# EasyEDA Pro project ProPrj_PRISM101 Scanner Backlight_2026-04-10.epro, board PRISM101 Backlight 4x6 RGBIR 20260324
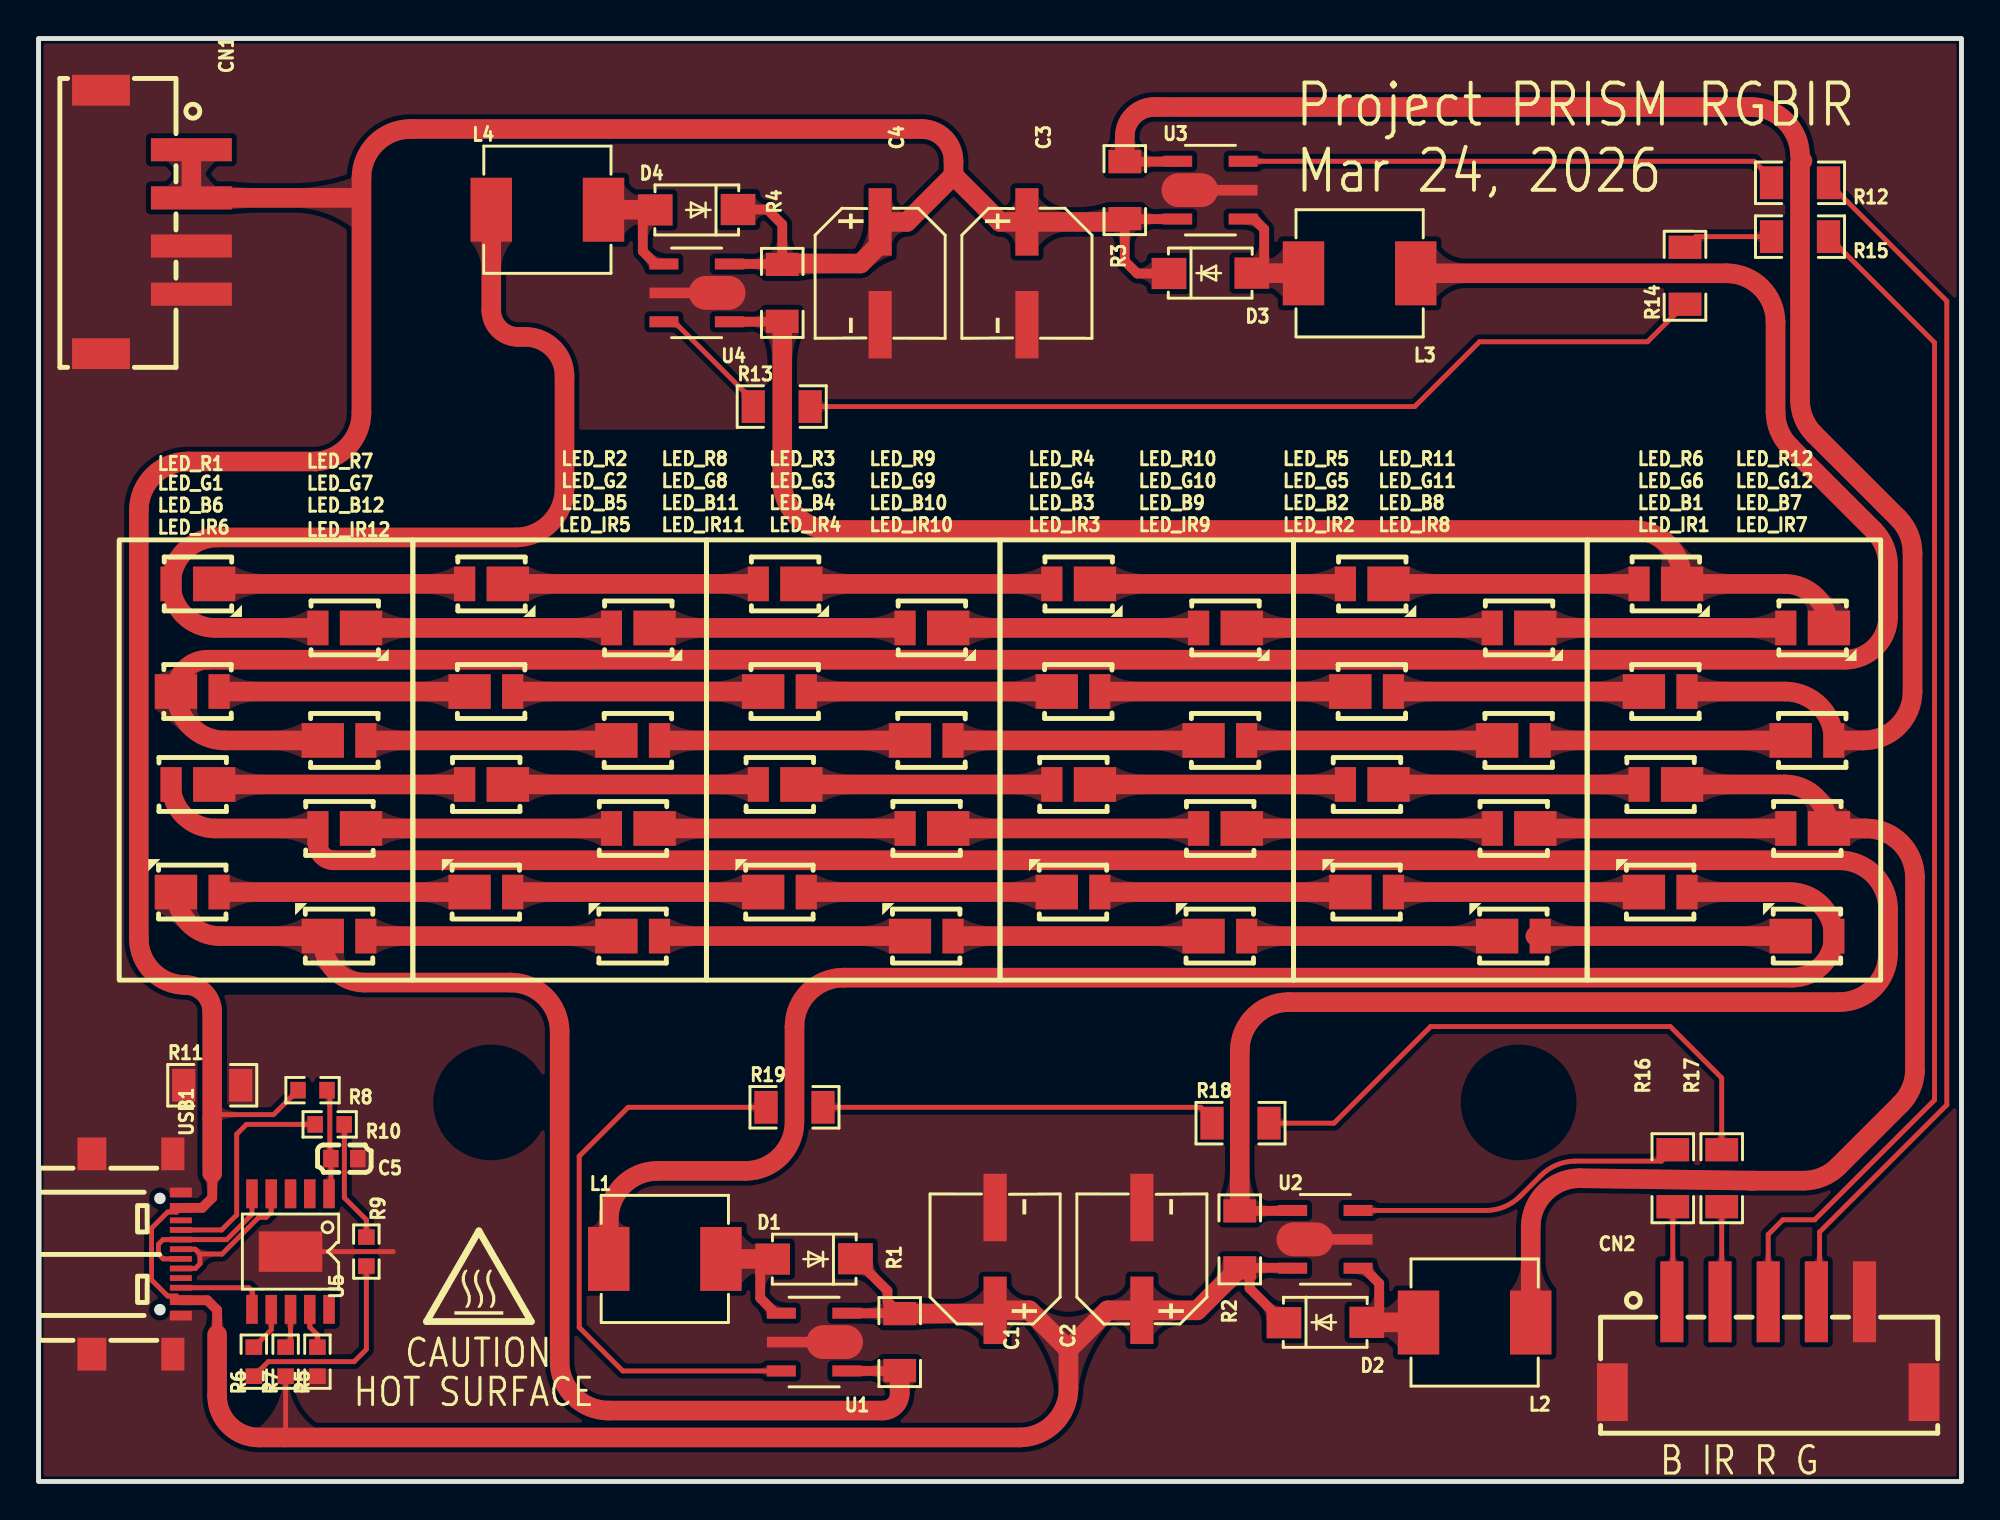
[diagram p7: board, top side]
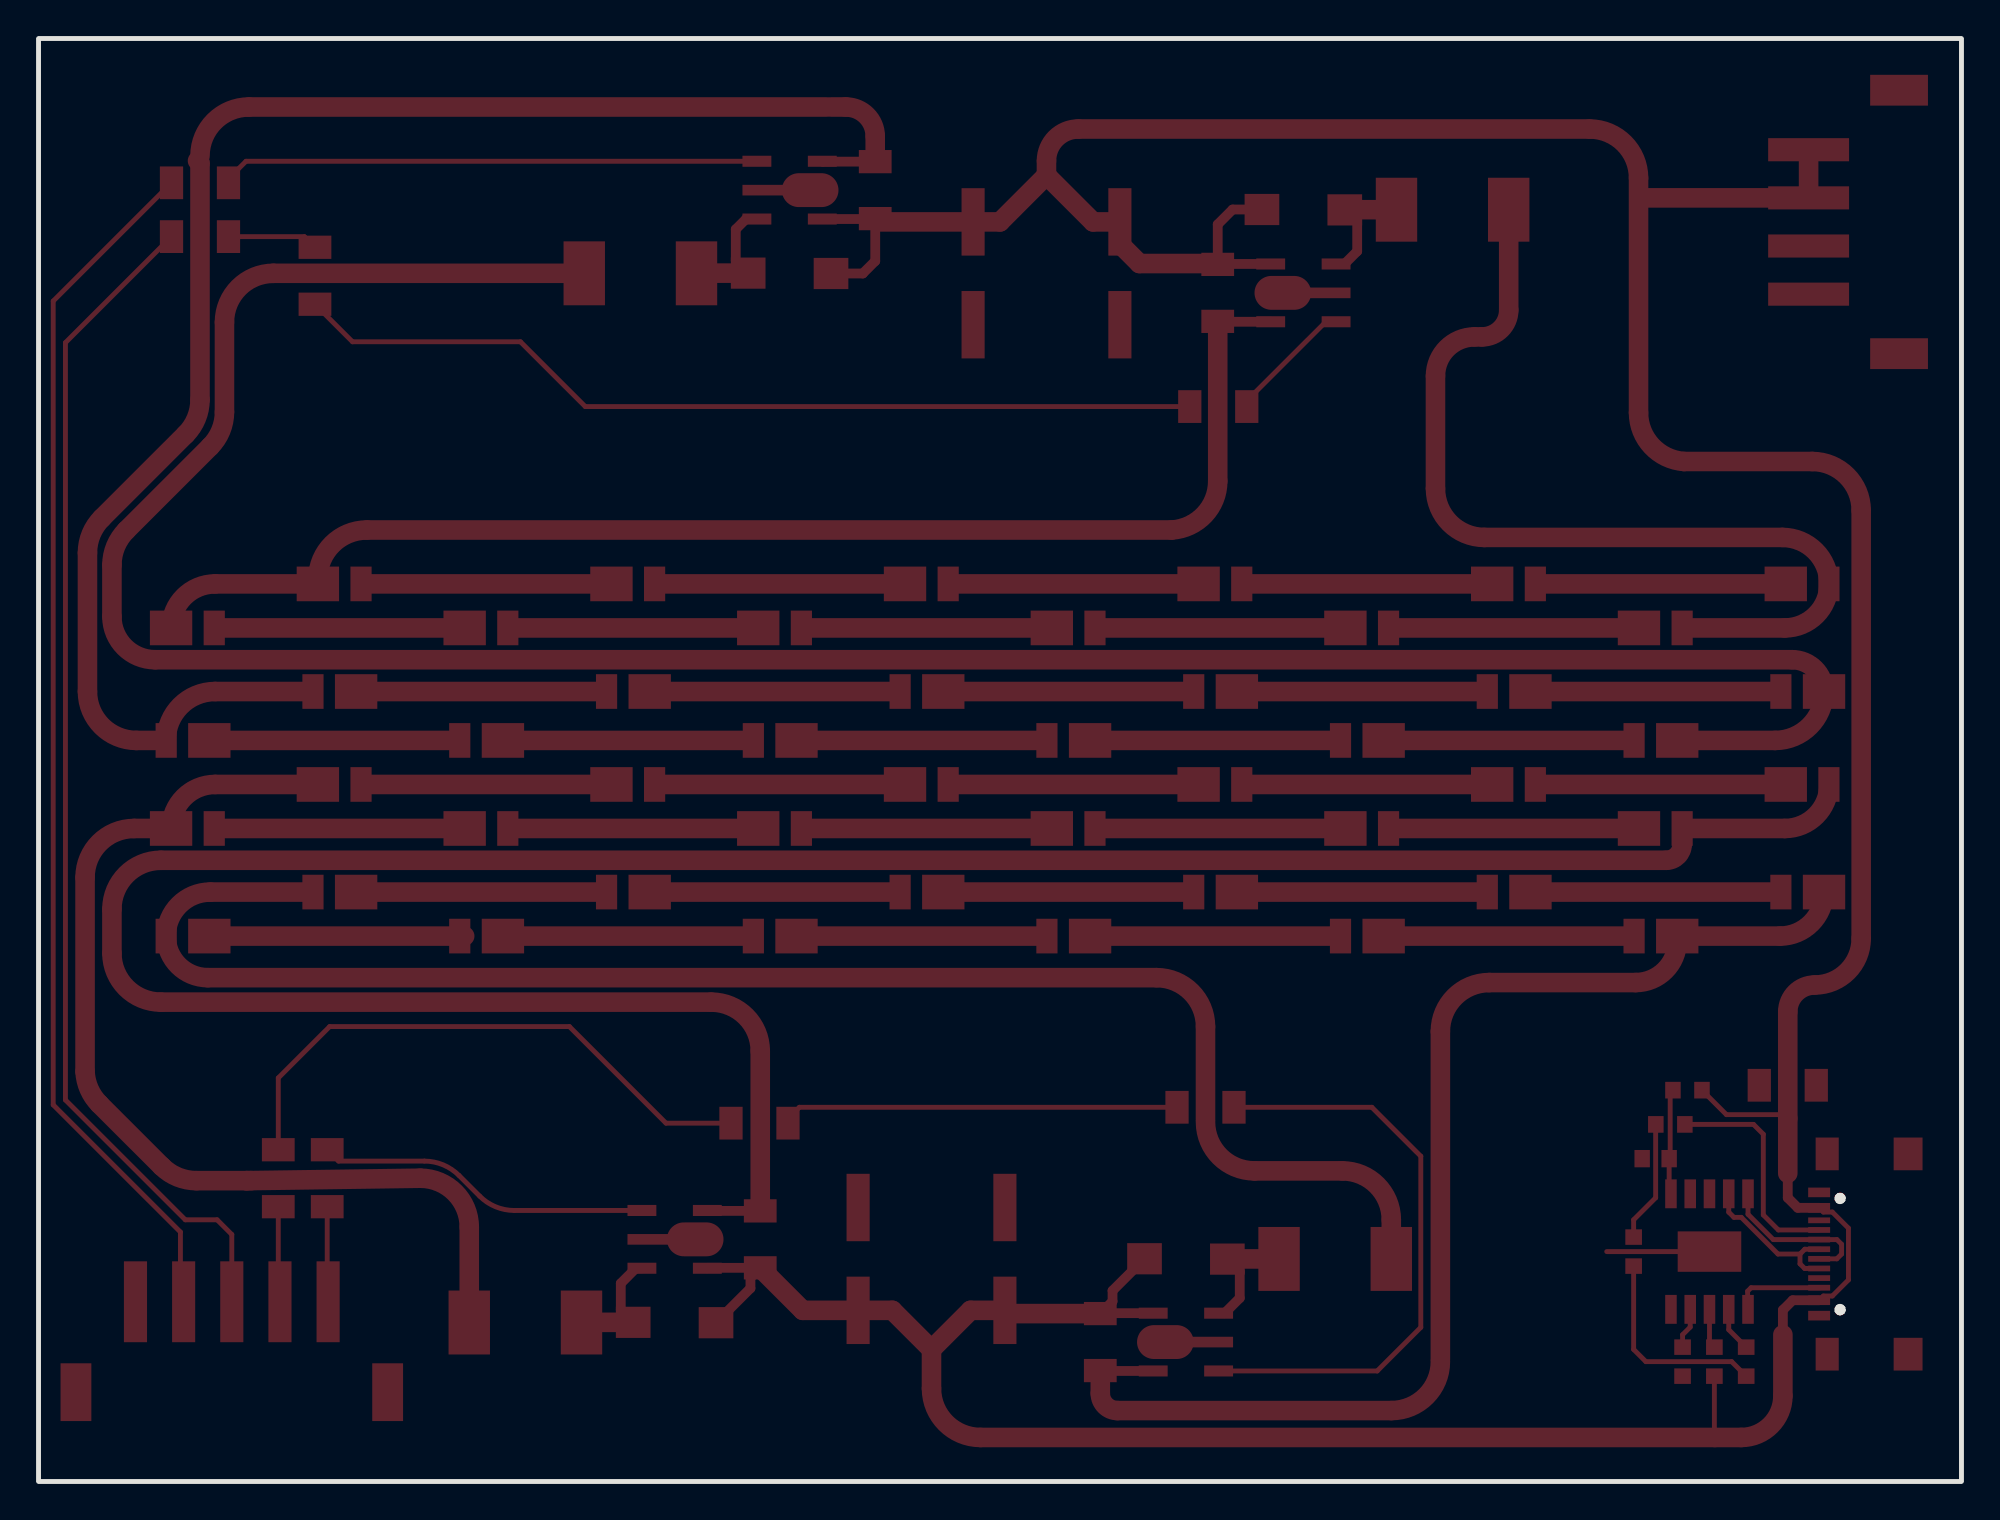
[diagram p8: board, bottom side, seen from below]

Outline 99.82 x 74.93 mm; copper layers: Top Layer, Bottom Layer. Coordinates in mm from the lower left corner of the outline.
Outline path: rectangle 0,74.93 99.82,0
Stack: Top Layer 0.035mm / Dielectric1 1.51mm FR4 er 4.5 / Bottom Layer 0.035mm

## Design rules (mm)
spacing copperThickness1oz (default): track to track 0.102, other pairs 0.152 to 0.3
spacing copperThickness2oz: track to track 0.203, other pairs 0.152 to 0.3
track width copperThickness1oz (default): min 0.127, default 0.254, max 2.54
track width copperThickness2oz: min 0.203, default 0.254, max 2.54
differential pair differentialPair (default): width min 0.127, default 0.254, max 2.54; gap min 0.152, default 0.152

## Placement (name value [footprint] x y rotation side)
C1  100uF  [CAP-SMD_BD6.3-L6.6-W6.6-LS7.3-FD-H7.7]  49.66 11.56 90 top
C2  100uF  [CAP-SMD_BD6.3-L6.6-W6.6-LS7.3-FD-H7.7]  57.28 11.56 90 top
C3  100uF  [CAP-SMD_BD6.3-L6.6-W6.6-LS7.3-FD-H7.7]  51.31 62.74 270 top
C4  100uF  [CAP-SMD_BD6.3-L6.6-W6.6-LS7.3-FD-H7.7]  43.69 62.74 270 top
C5  1uF  [C0603]  15.88 16.76 0 top
CN1  UK-2.54-4ALT  [CONN-SMD_UK-2.54-4ALT]  5.59 65.41 270 top
CN2  UK-2.54-5ALT  [CONN-SMD_5P-P2.50_UK-2.54-5ALT]  89.79 6.99 0 top
D1  SS36  [SMA_L4.3-W2.6-LS5.0-FD]  40.26 11.56 0 top
D2  SS36  [SMA_L4.3-W2.6-LS5.0-FD]  66.8 8.25 180 top
D3  SS36  [SMA_L4.3-W2.6-LS5.0-FD]  60.83 62.74 180 top
D4  SS36  [SMA_L4.3-W2.6-LS5.0-FD]  34.16 66.04 0 top
HOTSURFACE  CAUTION HOT SURFACE  [IEC_HotSurface_Small]  22.86 10.67 0 top
L1  68uH  [IND-SMD_L7.1-W6.6_H5.0]  32.51 11.56 0 top
L2  68uH  [IND-SMD_L7.1-W6.6_H5.0]  74.55 8.25 180 top
L3  68uH  [IND-SMD_L7.1-W6.6_H5.0]  68.58 62.74 180 top
L4  68uH  [IND-SMD_L7.1-W6.6_H5.0]  26.42 66.04 0 top
LED_B1  JE2835ARY-N-0002A0000-N0000001  [LED-SMD_L3.5-W2.8-JE2835BWT-N]  84.2 36.2 180 top
LED_B2  JE2835ARY-N-0002A0000-N0000001  [LED-SMD_L3.5-W2.8-JE2835BWT-N]  68.96 36.2 180 top
LED_B3  JE2835ARY-N-0002A0000-N0000001  [LED-SMD_L3.5-W2.8-JE2835BWT-N]  53.72 36.2 180 top
LED_B4  JE2835ARY-N-0002A0000-N0000001  [LED-SMD_L3.5-W2.8-JE2835BWT-N]  38.48 36.2 180 top
LED_B5  JE2835ARY-N-0002A0000-N0000001  [LED-SMD_L3.5-W2.8-JE2835BWT-N]  23.24 36.2 180 top
LED_B6  JE2835ARY-N-0002A0000-N0000001  [LED-SMD_L3.5-W2.8-JE2835BWT-N]  8 36.2 180 top
LED_B7  JE2835ARY-N-0002A0000-N0000001  [LED-SMD_L3.5-W2.8-JE2835BWT-N]  91.82 33.91 180 top
LED_B8  JE2835ARY-N-0002A0000-N0000001  [LED-SMD_L3.5-W2.8-JE2835BWT-N]  76.58 33.91 180 top
LED_B9  JE2835ARY-N-0002A0000-N0000001  [LED-SMD_L3.5-W2.8-JE2835BWT-N]  61.34 33.91 180 top
LED_B10  JE2835ARY-N-0002A0000-N0000001  [LED-SMD_L3.5-W2.8-JE2835BWT-N]  46.1 33.91 180 top
LED_B11  JE2835ARY-N-0002A0000-N0000001  [LED-SMD_L3.5-W2.8-JE2835BWT-N]  30.86 33.91 180 top
LED_B12  JE2835ARY-N-0002A0000-N0000001  [LED-SMD_L3.5-W2.8-JE2835BWT-N]  15.62 33.91 180 top
LED_G1  JE2835AGR-N-0002A0000-N0000001  [LED-SMD_L3.5-W2.8-JE2835BWT-N]  8.25 41.02 0 top
LED_G2  JE2835AGR-N-0002A0000-N0000001  [LED-SMD_L3.5-W2.8-JE2835BWT-N]  23.5 41.02 0 top
LED_G3  JE2835AGR-N-0002A0000-N0000001  [LED-SMD_L3.5-W2.8-JE2835BWT-N]  38.74 41.02 0 top
LED_G4  JE2835AGR-N-0002A0000-N0000001  [LED-SMD_L3.5-W2.8-JE2835BWT-N]  53.97 41.02 0 top
LED_G5  JE2835AGR-N-0002A0000-N0000001  [LED-SMD_L3.5-W2.8-JE2835BWT-N]  69.22 41.02 0 top
LED_G6  JE2835AGR-N-0002A0000-N0000001  [LED-SMD_L3.5-W2.8-JE2835BWT-N]  84.46 41.02 0 top
LED_G7  JE2835AGR-N-0002A0000-N0000001  [LED-SMD_L3.5-W2.8-JE2835BWT-N]  15.88 38.48 0 top
LED_G8  JE2835AGR-N-0002A0000-N0000001  [LED-SMD_L3.5-W2.8-JE2835BWT-N]  31.12 38.48 0 top
LED_G9  JE2835AGR-N-0002A0000-N0000001  [LED-SMD_L3.5-W2.8-JE2835BWT-N]  46.35 38.48 0 top
LED_G10  JE2835AGR-N-0002A0000-N0000001  [LED-SMD_L3.5-W2.8-JE2835BWT-N]  61.59 38.48 0 top
LED_G11  JE2835AGR-N-0002A0000-N0000001  [LED-SMD_L3.5-W2.8-JE2835BWT-N]  76.84 38.48 0 top
LED_G12  JE2835AGR-N-0002A0000-N0000001  [LED-SMD_L3.5-W2.8-JE2835BWT-N]  92.07 38.48 0 top
LED_IR1  JE2835AFR-N-0001A0000-N0000001  [LED-SMD_L3.5-W2.8_JE2835APO-N-0001A0000-N0000001]  84.46 30.61 180 top
LED_IR2  JE2835AFR-N-0001A0000-N0000001  [LED-SMD_L3.5-W2.8_JE2835APO-N-0001A0000-N0000001]  69.22 30.61 180 top
LED_IR3  JE2835AFR-N-0001A0000-N0000001  [LED-SMD_L3.5-W2.8_JE2835APO-N-0001A0000-N0000001]  53.97 30.61 180 top
LED_IR4  JE2835AFR-N-0001A0000-N0000001  [LED-SMD_L3.5-W2.8_JE2835APO-N-0001A0000-N0000001]  38.74 30.61 180 top
LED_IR5  JE2835AFR-N-0001A0000-N0000001  [LED-SMD_L3.5-W2.8_JE2835APO-N-0001A0000-N0000001]  23.5 30.61 180 top
LED_IR6  JE2835AFR-N-0001A0000-N0000001  [LED-SMD_L3.5-W2.8_JE2835APO-N-0001A0000-N0000001]  8.25 30.61 180 top
LED_IR7  JE2835AFR-N-0001A0000-N0000001  [LED-SMD_L3.5-W2.8_JE2835APO-N-0001A0000-N0000001]  92.07 28.32 180 top
LED_IR8  JE2835AFR-N-0001A0000-N0000001  [LED-SMD_L3.5-W2.8_JE2835APO-N-0001A0000-N0000001]  76.84 28.32 180 top
LED_IR9  JE2835AFR-N-0001A0000-N0000001  [LED-SMD_L3.5-W2.8_JE2835APO-N-0001A0000-N0000001]  61.59 28.32 180 top
LED_IR10  JE2835AFR-N-0001A0000-N0000001  [LED-SMD_L3.5-W2.8_JE2835APO-N-0001A0000-N0000001]  46.35 28.32 180 top
LED_IR11  JE2835AFR-N-0001A0000-N0000001  [LED-SMD_L3.5-W2.8_JE2835APO-N-0001A0000-N0000001]  31.12 28.32 180 top
LED_IR12  JE2835AFR-N-0001A0000-N0000001  [LED-SMD_L3.5-W2.8_JE2835APO-N-0001A0000-N0000001]  15.88 28.32 180 top
LED_R1  JE2835AHR-N-0001A0000-N0000001  [LED-SMD_L3.5-W2.8_JE2835APO-N-0001A0000-N0000001]  8 46.61 0 top
LED_R2  JE2835AHR-N-0001A0000-N0000001  [LED-SMD_L3.5-W2.8_JE2835APO-N-0001A0000-N0000001]  23.24 46.61 0 top
LED_R3  JE2835AHR-N-0001A0000-N0000001  [LED-SMD_L3.5-W2.8_JE2835APO-N-0001A0000-N0000001]  38.48 46.61 0 top
LED_R4  JE2835AHR-N-0001A0000-N0000001  [LED-SMD_L3.5-W2.8_JE2835APO-N-0001A0000-N0000001]  53.72 46.61 0 top
LED_R5  JE2835AHR-N-0001A0000-N0000001  [LED-SMD_L3.5-W2.8_JE2835APO-N-0001A0000-N0000001]  68.96 46.61 0 top
LED_R6  JE2835AHR-N-0001A0000-N0000001  [LED-SMD_L3.5-W2.8_JE2835APO-N-0001A0000-N0000001]  84.2 46.61 0 top
LED_R7  JE2835AHR-N-0001A0000-N0000001  [LED-SMD_L3.5-W2.8_JE2835APO-N-0001A0000-N0000001]  15.62 44.32 0 top
LED_R8  JE2835AHR-N-0001A0000-N0000001  [LED-SMD_L3.5-W2.8_JE2835APO-N-0001A0000-N0000001]  30.86 44.32 0 top
LED_R9  JE2835AHR-N-0001A0000-N0000001  [LED-SMD_L3.5-W2.8_JE2835APO-N-0001A0000-N0000001]  46.1 44.32 0 top
LED_R10  JE2835AHR-N-0001A0000-N0000001  [LED-SMD_L3.5-W2.8_JE2835APO-N-0001A0000-N0000001]  61.34 44.32 0 top
LED_R11  JE2835AHR-N-0001A0000-N0000001  [LED-SMD_L3.5-W2.8_JE2835APO-N-0001A0000-N0000001]  76.58 44.32 0 top
LED_R12  JE2835AHR-N-0001A0000-N0000001  [LED-SMD_L3.5-W2.8_JE2835APO-N-0001A0000-N0000001]  91.82 44.32 0 top
R1  0.3R  [R1206]  44.7 7.24 270 top
R2  0.3R  [R1206]  62.36 12.57 90 top
R3  0.3R  [R1206]  56.39 67.06 90 top
R4  0.3R  [R1206]  38.61 61.72 270 top
R5  NC / 120K  [R0603]  14.48 6.22 270 top
R6  0R  [R0603]  11.18 6.22 90 top
R7  10K / 0R  [R0603]  12.83 6.22 270 top
R8  1K / 0R  [R0603]  14.22 20.32 0 top
R9  0R  [R0603]  17.02 11.94 90 top
R10  0R  [R0603]  15.11 18.54 180 top
R11  0R  [R1206]  9.02 20.57 0 top
R12  0R  [R1206]  91.44 67.44 0 top
R13  0R  [R1206]  38.58 55.82 0 top
R14  0R  [R1206]  85.47 62.61 90 top
R15  0R  [R1206]  91.44 64.64 0 top
R16  0R  [R1206]  84.84 15.75 270 top
R17  0R  [R1206]  87.38 15.75 270 top
R18  0R  [R1206]  62.4 18.61 0 top
R19  0R  [R1206]  39.24 19.43 0 top
U1  PT4115  [SOT-89-5_L4.5-W2.5-P1.50-LS4.5-BR]  40.26 7.24 180 top
U2  PT4115  [SOT-89-5_L4.5-W2.5-P1.50-LS4.5-BR]  66.8 12.57 0 top
U3  PT4115  [SOT-89-5_L4.5-W2.5-P1.50-LS4.5-BR]  60.83 67.06 0 top
U4  PT4115  [SOT-89-5_L4.5-W2.5-P1.50-LS4.5-BR]  34.16 61.72 180 top
U5  CH224K / CH224A  [ESSOP-10_L4.9-W3.9-P1.0-LS6.0-TL-EP]  13.08 11.94 180 top
USB1  TYPE-C 16P QTWT  [USB-TYPE-C-SMD_TYPE-C-16P-QTWT]  5.08 11.81 270 top

## Footprints (pads in the part's own frame, mm; a bottom-side part is the same pattern mirrored in y, then rotated)
C0603
  rect 0.8x0.9 smd: 1(-0.7,0) 2(0.7,0)
CAP-SMD_BD6.3-L6.6-W6.6-LS7.3-FD-H7.7
  rect 3.5x1.2 smd: 1(-2.67,0) 2(2.67,0)
CONN-SMD_5P-P2.50_UK-2.54-5ALT
  rect 1.2x4.2 smd: 1(-5,2.348) 2(-2.5,2.348) 3(0,2.348) 4(2.5,2.348) 5(5,2.348)
  rect 1.6x3 smd: 6(8.09,-2.348) 7(-8.09,-2.348)
CONN-SMD_UK-2.54-4ALT
  rect 1.2x4.2 smd: 1(-3.75,2.348) 2(-1.25,2.348) 3(1.25,2.348) 4(3.75,2.348)
  rect 1.6x3 smd: 5(6.84,-2.348) 6(-6.84,-2.348)
ESSOP-10_L4.9-W3.9-P1.0-LS6.0-TL-EP
  rect 0.6x1.5 smd: 1(-2,-3) 2(-1,-3) 3(0,-3) 4(1,-3) 5(2,-3) 6(2,3) 7(1,3) 8(0,3) 9(-1,3) 10(-2,3)
  rect 3.3x2.1 smd: 11(0,0)
IND-SMD_L7.1-W6.6_H5.0
  rect 2.15x3.32 smd: 1(-2.913,0) 2(2.913,0)
LED-SMD_L3.5-W2.8-JE2835BWT-N
  rect 2.2x1.8 smd: 1(-1.12,0)
  rect 1.1x1.8 smd: 2(1.12,0)
LED-SMD_L3.5-W2.8_JE2835APO-N-0001A0000-N0000001
  rect 1.1x1.8 smd: 1(-1.12,0)
  rect 2.2x1.8 smd: 2(1.12,0)
R0603
  rect 0.806x0.864 smd: 1(-0.753,0) 2(0.753,0)
R1206
  rect 1.208x1.701 smd: 1(-1.479,0) 2(1.479,0)
SMA_L4.3-W2.6-LS5.0-FD
  rect 1.8x1.62 smd: 1(-2.15,-0.009) 2(2.15,0.009)
SOT-89-5_L4.5-W2.5-P1.50-LS4.5-BR
  rect 1.5x0.574 smd: 1(1.698,-1.5) 3(1.698,1.5) 4(-1.698,1.5) 5(-1.698,-1.5)
  oval 2.94x1.76 smd: 2(-1.067,0)
  rect 2.209x0.552 smd: 2(1.343,0)
USB-TYPE-C-SMD_TYPE-C-16P-QTWT
  rect 1.7x1.2 smd: 0(-5.2,1.891) 0(5.2,1.891)
  rect 1.7x1.5 smd: 0(-5.2,-2.309) 0(5.2,-2.309)
  rect 0.5x1.14 smd: A1(-3.2,2.308) A4(-2.4,2.308) A9(2.4,2.308) A12(3.2,2.308)
  rect 0.3x1.14 smd: A5(-1.25,2.308) A6(-0.25,2.308) A7(0.25,2.308) A8(1.25,2.309) B5(1.75,2.308) B6(0.75,2.308) B7(-0.75,2.308) B8(-1.75,2.309)

## Nets
As in the schematic.

Pads without a net: U5 2 3 10; USB1 A8 B8

## Routing (per net, layer and track width the routed paths; a pad name or vN(x,y) marks a point on that pad's centre or on a via; arc(x,y) is an arc through that point)
GND: length 5.3
  Top Layer w0.254: U5.11 18.42,11.94
VCC: length 251.3
  Top Layer w0.254: 9.02,18.85 9.21,19.05 12.2,19.05 R8.1 ; USB1.A4 7.17,13.99 6.7,13.99 5.87,13.15 5.87,10.47 6.7,9.63 7.17,9.63 USB1.A9 ; R7.2 12.83,2.31 arc(12.82,2.29) 12.8,2.29
  Top Layer w0.508: 9.27,7.62 9.27,8.9 8.76,9.41 USB1.A9 ; U1.5 44.68,8.74 ; 44.68,8.74 44.07,9.35 44.07,9.91 D1.2 ; 44.68,8.74 R1.1 ; R3.1 56.39,63.37 57.03,62.73 D3.2 ; D2.2 62.87,10.03 62.87,10.59 R2.1 65.08,11.09 U2.5 ; U3.5 56.41,65.56 ; USB1.A4 8.5,14.21 9.02,14.73 9.02,16 ; 36.31,66.05 37.84,66.05 38.61,65.28 R4.1 38.59,63.22 U4.5
  Top Layer w1.016: R2.1 60.15,8.89 55.5,8.89 53.47,6.86 ; 9.27,7.62 9.27,4.44 arc(9.9,2.92) 11.43,2.29 50.93,2.29 arc(52.72,3.03) 53.47,4.83 53.47,6.86 ; R1.1 49.49,8.72 49.66,8.89 51.44,8.89 53.47,6.86 ; 16.64,66.66 CN1.2 CN1.1 ; 9.02,16 9.02,24.38 arc(8.61,25.37) 7.62,25.78 arc(5.91,26.49) 5.21,28.19 5.21,50.43 arc(5.95,52.22) 7.75,52.97 14.4,52.97 arc(16.08,53.77) 16.76,55.5 16.76,67.69 arc(17.51,69.49) 19.3,70.23 45.85,70.23 arc(47.01,69.75) 47.5,68.58 47.5,67.95 arc(47.5,67.89) 47.5,67.82 ; 56.22,65.41 C3.1 49.91,65.41 47.5,67.82 ; 47.5,67.82 45.08,65.41 C4.1 43.69,64.26 42.67,63.25 38.65,63.25 R4.1
VDD: length 5.4
  Top Layer w0.254: U5.1 15.17,15.03 C5.1 15.12,16.82 15.12,20.32
DIM_B: length 17.4
  Top Layer w0.254: U2.3 75.12,14.07 arc(76.1,14.27) 76.92,14.82 78,15.89 arc(78.82,16.44) 79.79,16.64 84.25,16.64 84.84,17.23
DIM_G: length 28
  Top Layer w0.254: R12.1 89.96,67.65 89.05,68.56 U3.3
DIM_R: length 6.6
  Top Layer w0.254: R13.1 37.1,56.12 33,60.22 U4.3
DIM_W: length 31.1
  Top Layer w0.254: R19.1 30.61,19.43 28.07,16.89 28.07,8 30.33,5.74 U1.3
PD_USB_CC1: length 11.6
  Top Layer w0.254: 14.23,18.54 10.8,18.54 10.29,18.03 10.29,13.84 9.5,13.06 USB1.A5
PD_USB_CC2: length 4.8
  Top Layer w0.254: 7.33,10.06 10.92,10.06 11.1,9.88 11.1,8.96 U5.6
PD_USB_DM: length 8.3
  Top Layer w0.254: 7.33,11.56 6.47,11.56 6.22,11.81 6.22,12.32 6.47,12.56 USB1.B7 9.77,12.56 11.08,13.88 U5.5
PD_USB_DP: length 8.4
  Top Layer w0.254: 7.33,11.06 8.14,11.06 8.38,11.3 8.38,11.81 ; 8.38,11.81 9.53,11.81 11.43,13.72 11.81,13.72 12.08,13.99 U5.4 ; 8.38,11.81 8.13,12.06 7.33,12.06
$1N6: length 69.9
  Top Layer w0.508: U4.4 38.59,60.22 R4.2
  Top Layer w1.016: R4.2 38.61,51.94 arc(39.3,50.2) 40.99,49.41 82.78,49.41 arc(84.58,48.66) 85.32,46.87 LED_R6.2 90.66,46.61 arc(92.27,45.94) LED_R12.2
$1N14: length 6.2
  Top Layer w0.508: U4.1 32.03,63.22 31.37,63.88 31.37,66.03
  Top Layer w1.016: D4.1 32,66.04 L4.2
$1N15: length 49
  Top Layer w1.016: L4.1 23.5,60.83 arc(23.91,59.84) 24.89,59.44 25.27,59.44 arc(26.71,58.84) 27.31,57.4 27.31,51.56 arc(26.56,49.77) 24.77,49.02 9.29,49.02 arc(7.59,48.32) LED_R1.1 arc(7.55,44.99) 9.17,44.32 LED_R7.1
$1N18: length 85.6
  Top Layer w0.508: R3.2 59.12,68.54 U3.4
  Top Layer w1.016: 58.93,71.37 88.9,71.37 arc(90.7,70.63) 91.44,68.83 ; LED_G6.2 90.66,41.02 arc(92.45,40.28) LED_G12.2 94.74,38.48 arc(96.54,39.22) 97.28,41.02 97.28,48.22 arc(97.09,49.2) 96.54,50.02 92.18,54.37 arc(91.63,55.2) 91.44,56.17 91.44,68.45 arc(91.48,68.54) 91.57,68.58 ; R3.2 56.39,69.85 arc(56.83,70.93) 57.91,71.37 58.67,71.37
$1N19: length 6.5
  Top Layer w0.508: D3.1 63.63,63.39 63.63,65.02 63.09,65.56 U3.1
  Top Layer w1.016: 65.67,62.74 65.66,62.75 D3.1
$1N20: length 137.8
  Top Layer w1.016: LED_G7.1 9.67,38.48 arc(7.88,39.22) 7.14,41.02 arc(7.62,42.19) 8.79,42.67 93.77,42.67 arc(95.36,43.33) 96.01,44.91 96.01,47.59 arc(95.82,48.56) 95.27,49.39 90.91,53.74 arc(90.36,54.56) 90.17,55.54 90.17,60.2 arc(89.43,61.99) 87.63,62.74 L3.1
$1N22: length 13
  Top Layer w1.016: LED_G2.1 LED_G1.2
$1N23: length 13
  Top Layer w1.016: LED_G2.2 LED_G3.1
$1N24: length 13
  Top Layer w1.016: LED_G3.2 LED_G4.1
$1N28: length 143.1
  Top Layer w0.508: R2.2 65.08,14.05 U2.4
  Top Layer w1.016: R2.2 62.36,22.35 arc(63.1,24.15) 64.9,24.89 93.47,24.89 arc(95.27,25.64) 96.01,27.43 96.01,29.72 arc(95.27,31.51) 93.47,32.26 15.33,32.26 arc(14.74,32.5) 14.5,33.08 LED_B12.2 9.17,33.91 arc(7.55,34.58) LED_B6.2
$1N29: length 6.4
  Top Layer w0.508: U2.1 68.81,11.07 69.6,10.29 69.6,8.91 D2.1
  Top Layer w1.016: L2.2 71.63,8.26 D2.1
$1N30: length 54.2
  Top Layer w1.016: 88.77,15.62 89.03,15.62 ; 89.03,15.62 80,15.75 arc(78.21,15) 77.46,13.21 L2.1 ; 89.03,15.62 91.63,15.62 arc(92.6,15.81) 93.43,16.37 96.66,19.6 arc(97.19,20.37) 97.41,21.28 97.41,31.37 arc(96.66,33.17) 94.87,33.91 LED_B7.1 arc(92.27,35.53) 90.66,36.2 LED_B1.1
$1N32: length 13
  Top Layer w1.016: 70.08,36.2 LED_B1.2
$1N33: length 13
  Top Layer w1.016: LED_B3.1 LED_B2.2
$1N34: length 13
  Top Layer w1.016: LED_B3.2 LED_B4.1
$1N38: length 64.7
  Top Layer w0.508: R1.2 44.68,5.74 U1.4
  Top Layer w1.016: 27.05,6.35 27.05,23.37 arc(26.31,25.16) 24.51,25.91 16.91,25.91 arc(15.39,26.54) 14.75,28.07 LED_IR12.2 9.42,28.32 arc(7.8,28.99) 7.14,30.61 ; R1.2 44.7,4.57 arc(44.44,3.94) 43.81,3.68 29.59,3.68 arc(27.79,4.43) 27.05,6.22
$1N39: length 6.4
  Top Layer w0.508: U1.1 38.25,8.74 37.47,9.53 37.47,10.9 D1.1
  Top Layer w1.016: L1.2 38.1,11.56 D1.1
$1N40: length 85
  Top Layer w1.016: L1.1 29.6,13.59 arc(30.34,15.39) 32.14,16.13 36.7,16.13 arc(38.5,16.87) 39.24,18.67 ; LED_IR1.1 90.91,30.61 arc(92.53,29.94) LED_IR7.1 arc(92.56,26.79) 91.04,26.16 41.78,26.16 arc(39.99,25.42) 39.24,23.62 39.24,18.8
$1N42: length 13
  Top Layer w1.016: LED_IR2.1 LED_IR1.2
$1N43: length 13
  Top Layer w1.016: LED_IR3.1 LED_IR2.2
$1N44: length 13
  Top Layer w1.016: LED_IR4.1 LED_IR3.2
$1N66: length 2.1
  Top Layer w0.254: U5.9 14.08,8.02 14.48,7.62 R5.1
$1N75: length 2.3
  Top Layer w0.254: U5.7 12.08,7.88 R6.2
$1N76: length 2.1
  Top Layer w0.254: U5.8 13.08,7.23 R7.1
$1N80: length 6.3
  Top Layer w0.254: R10.1 15.88,18.53 15.88,14.73 17.02,13.59 R9.2
$1N82: length 10.7
  Top Layer w0.254: R9.1 17.02,6.86 16.38,6.22 11.93,6.22 R6.1
$1N102: length 63.5
  Top Layer w0.254: CN2.4 92.46,9.5 92.46,12.95 99.06,19.56 99.06,61.3 R12.2
$1N104: length 47.6
  Top Layer w0.254: 40.06,55.82 71.44,55.82 74.8,59.18 83.52,59.18 R14.1
$1N105: length 4.7
  Top Layer w0.254: R15.1 86.02,64.64 R14.2
$1N106: length 62.1
  Top Layer w0.254: CN2.3 89.79,12.83 90.55,13.59 92.2,13.59 98.43,19.81 98.43,59.14 R15.2
$1N110: length 5
  Top Layer w0.254: CN2.2 87.38,9.42 R17.2
$1N111: length 5
  Top Layer w0.254: CN2.1 84.84,9.38 R16.2
$1N112: length 30.4
  Top Layer w0.254: R18.2 67.25,18.61 72.26,23.62 84.71,23.62 87.38,20.96 87.38,17.23
$1N114: length 20.7
  Top Layer w0.254: R19.2 60.32,19.43 60.92,18.84 R18.1
$1N115: length 13
  Top Layer w1.016: LED_IR5.1 LED_IR4.2
$1N116: length 13
  Top Layer w1.016: LED_IR6.1 LED_IR5.2
$1N117: length 13
  Top Layer w1.016: LED_B4.2 LED_B5.1
$1N118: length 13
  Top Layer w1.016: LED_B5.2 9.12,36.2
$1N119: length 13
  Top Layer w1.016: LED_G5.1 LED_G4.2
$1N120: length 13
  Top Layer w1.016: LED_G5.2 LED_G6.1
$1N121: length 13
  Top Layer w1.016: LED_R4.2 LED_R5.1
$1N122: length 13
  Top Layer w1.016: LED_R6.1 70.08,46.61
$1N123: length 13
  Top Layer w1.016: LED_R12.1 LED_R11.2
$1N124: length 13
  Top Layer w1.016: LED_R10.2 LED_R11.1
$1N128: length 13
  Top Layer w1.016: LED_G11.2 90.96,38.48
$1N129: length 13
  Top Layer w1.016: LED_G10.2 LED_G11.1
$1N131: length 13
  Top Layer w1.016: LED_G7.2 LED_G8.1
$1N132: length 13
  Top Layer w1.016: 45.24,38.48 LED_G8.2
$1N133: length 13
  Top Layer w1.016: LED_G10.1 LED_G9.2
$1N134: length 13
  Top Layer w1.016: LED_B12.1 29.74,33.91
$1N135: length 13
  Top Layer w1.016: LED_B10.2 LED_B11.1
$1N137: length 13
  Top Layer w1.016: LED_B7.2 LED_B8.1
$1N138: length 13
  Top Layer w1.016: LED_B8.2 LED_B9.1
$1N139: length 13
  Top Layer w1.016: LED_B10.1 LED_B9.2
$1N140: length 13
  Top Layer w1.016: LED_IR12.1 LED_IR11.2
$1N141: length 13
  Top Layer w1.016: LED_IR11.1 45.24,28.32
$1N143: length 13.3
  Top Layer w1.016: 90.96,28.32 77.7,28.32
$1N144: length 13
  Top Layer w1.016: LED_IR9.1 LED_IR8.2
$1N145: length 13
  Top Layer w1.016: LED_IR10.1 LED_IR9.2
$1N148: length 13
  Top Layer w1.016: 9.12,46.61 LED_R2.1
$1N149: length 13
  Top Layer w1.016: LED_R7.2 29.74,44.32
$1N150: length 13
  Top Layer w1.016: LED_R8.2 LED_R9.1
$1N151: length 13
  Top Layer w1.016: LED_R3.1 LED_R2.2
$1N152: length 13
  Top Layer w1.016: LED_R9.2 LED_R10.1
$1N153: length 13
  Top Layer w1.016: LED_R4.1 LED_R3.2

## Copper pours and planes (outline as drawn; the poured copper is in the pictures)
GND on Top Layer: -2.67,77.34 103,77.34 103,-3.56 -2.67,-3.56

Small or netless copper shapes (teardrops, artwork), in the pictures only: 222 on Top Layer

## Text on the board
Top Silkscreen Layer: HOT SURFACE | CAUTION | B IR R G | Project PRISM RGBIR / Mar 24, 2026
